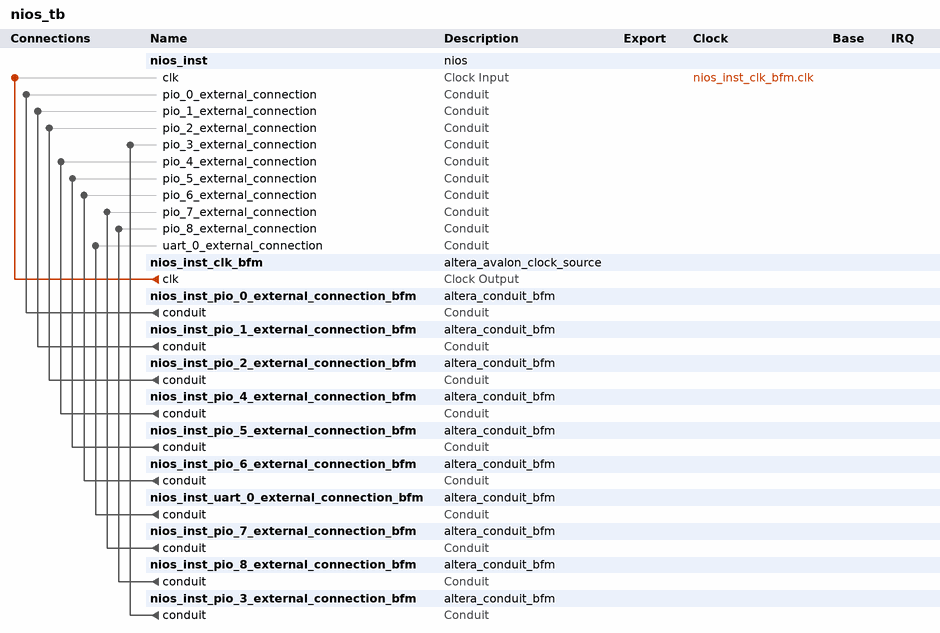
[diagram p0: system contents]
# Platform Designer (Qsys) system nios_tb, Cyclone IV E EP4CE22E22C6
# Parameters at their usual value, and those the tool derives, are not listed.
package require -exact qsys 13.1
create_system nios_tb
set_project_property DEVICE_FAMILY {Cyclone IV E}
set_project_property DEVICE EP4CE22E22C6

add_instance nios_inst nios 1.0

add_instance nios_inst_clk_bfm altera_avalon_clock_source 13.1

add_instance nios_inst_pio_0_external_connection_bfm altera_conduit_bfm 13.1
set_instance_parameter_value nios_inst_pio_0_external_connection_bfm CLOCKED_SIGNAL false
set_instance_parameter_value nios_inst_pio_0_external_connection_bfm ENABLE_RESET false
set_instance_parameter_value nios_inst_pio_0_external_connection_bfm SIGNAL_WIDTHS 1
set_instance_parameter_value nios_inst_pio_0_external_connection_bfm SIGNAL_DIRECTIONS output

add_instance nios_inst_pio_1_external_connection_bfm altera_conduit_bfm 13.1
set_instance_parameter_value nios_inst_pio_1_external_connection_bfm CLOCKED_SIGNAL false
set_instance_parameter_value nios_inst_pio_1_external_connection_bfm ENABLE_RESET false
set_instance_parameter_value nios_inst_pio_1_external_connection_bfm SIGNAL_WIDTHS 1
set_instance_parameter_value nios_inst_pio_1_external_connection_bfm SIGNAL_DIRECTIONS output

add_instance nios_inst_pio_2_external_connection_bfm altera_conduit_bfm 13.1
set_instance_parameter_value nios_inst_pio_2_external_connection_bfm CLOCKED_SIGNAL false
set_instance_parameter_value nios_inst_pio_2_external_connection_bfm ENABLE_RESET false
set_instance_parameter_value nios_inst_pio_2_external_connection_bfm SIGNAL_WIDTHS 1
set_instance_parameter_value nios_inst_pio_2_external_connection_bfm SIGNAL_DIRECTIONS output

add_instance nios_inst_pio_4_external_connection_bfm altera_conduit_bfm 13.1
set_instance_parameter_value nios_inst_pio_4_external_connection_bfm CLOCKED_SIGNAL false
set_instance_parameter_value nios_inst_pio_4_external_connection_bfm ENABLE_RESET false
set_instance_parameter_value nios_inst_pio_4_external_connection_bfm SIGNAL_WIDTHS 8
set_instance_parameter_value nios_inst_pio_4_external_connection_bfm SIGNAL_DIRECTIONS input

add_instance nios_inst_pio_5_external_connection_bfm altera_conduit_bfm 13.1
set_instance_parameter_value nios_inst_pio_5_external_connection_bfm CLOCKED_SIGNAL false
set_instance_parameter_value nios_inst_pio_5_external_connection_bfm ENABLE_RESET false
set_instance_parameter_value nios_inst_pio_5_external_connection_bfm SIGNAL_WIDTHS 1
set_instance_parameter_value nios_inst_pio_5_external_connection_bfm SIGNAL_DIRECTIONS input

add_instance nios_inst_pio_6_external_connection_bfm altera_conduit_bfm 13.1
set_instance_parameter_value nios_inst_pio_6_external_connection_bfm CLOCKED_SIGNAL false
set_instance_parameter_value nios_inst_pio_6_external_connection_bfm ENABLE_RESET false
set_instance_parameter_value nios_inst_pio_6_external_connection_bfm SIGNAL_WIDTHS 1
set_instance_parameter_value nios_inst_pio_6_external_connection_bfm SIGNAL_DIRECTIONS input

add_instance nios_inst_uart_0_external_connection_bfm altera_conduit_bfm 13.1
set_instance_parameter_value nios_inst_uart_0_external_connection_bfm CLOCKED_SIGNAL false
set_instance_parameter_value nios_inst_uart_0_external_connection_bfm ENABLE_RESET false
set_instance_parameter_value nios_inst_uart_0_external_connection_bfm SIGNAL_ROLES rxd,txd
set_instance_parameter_value nios_inst_uart_0_external_connection_bfm SIGNAL_WIDTHS 1,1
set_instance_parameter_value nios_inst_uart_0_external_connection_bfm SIGNAL_DIRECTIONS output,input

add_instance nios_inst_pio_7_external_connection_bfm altera_conduit_bfm 13.1
set_instance_parameter_value nios_inst_pio_7_external_connection_bfm CLOCKED_SIGNAL false
set_instance_parameter_value nios_inst_pio_7_external_connection_bfm ENABLE_RESET false
set_instance_parameter_value nios_inst_pio_7_external_connection_bfm SIGNAL_WIDTHS 8
set_instance_parameter_value nios_inst_pio_7_external_connection_bfm SIGNAL_DIRECTIONS output

add_instance nios_inst_pio_8_external_connection_bfm altera_conduit_bfm 13.1
set_instance_parameter_value nios_inst_pio_8_external_connection_bfm CLOCKED_SIGNAL false
set_instance_parameter_value nios_inst_pio_8_external_connection_bfm ENABLE_RESET false
set_instance_parameter_value nios_inst_pio_8_external_connection_bfm SIGNAL_WIDTHS 8
set_instance_parameter_value nios_inst_pio_8_external_connection_bfm SIGNAL_DIRECTIONS input

add_instance nios_inst_pio_3_external_connection_bfm altera_conduit_bfm 13.1
set_instance_parameter_value nios_inst_pio_3_external_connection_bfm CLOCKED_SIGNAL false
set_instance_parameter_value nios_inst_pio_3_external_connection_bfm ENABLE_RESET false
set_instance_parameter_value nios_inst_pio_3_external_connection_bfm SIGNAL_WIDTHS 1
set_instance_parameter_value nios_inst_pio_3_external_connection_bfm SIGNAL_DIRECTIONS output

# connections
add_connection nios_inst_clk_bfm.clk nios_inst.clk clock
add_connection nios_inst_pio_0_external_connection_bfm.conduit nios_inst.pio_0_external_connection conduit
add_connection nios_inst_pio_1_external_connection_bfm.conduit nios_inst.pio_1_external_connection conduit
add_connection nios_inst_pio_2_external_connection_bfm.conduit nios_inst.pio_2_external_connection conduit
add_connection nios_inst_pio_3_external_connection_bfm.conduit nios_inst.pio_3_external_connection conduit
add_connection nios_inst_pio_4_external_connection_bfm.conduit nios_inst.pio_4_external_connection conduit
add_connection nios_inst_pio_5_external_connection_bfm.conduit nios_inst.pio_5_external_connection conduit
add_connection nios_inst_pio_6_external_connection_bfm.conduit nios_inst.pio_6_external_connection conduit
add_connection nios_inst_pio_7_external_connection_bfm.conduit nios_inst.pio_7_external_connection conduit
add_connection nios_inst_pio_8_external_connection_bfm.conduit nios_inst.pio_8_external_connection conduit
add_connection nios_inst_uart_0_external_connection_bfm.conduit nios_inst.uart_0_external_connection conduit

set_interconnect_requirement {$system} qsys_mm.clockCrossingAdapter HANDSHAKE
set_interconnect_requirement {$system} qsys_mm.maxAdditionalLatency 1
set_interconnect_requirement {$system} qsys_mm.insertDefaultSlave false

save_system nios_tb.qsys
